# Altium schematic sheet digital_pot.SchDoc
size A4; Engineer: Amir Hossein Jobeiri; Organization: Simaran; SheetNumber: 21; SheetTotal: 24
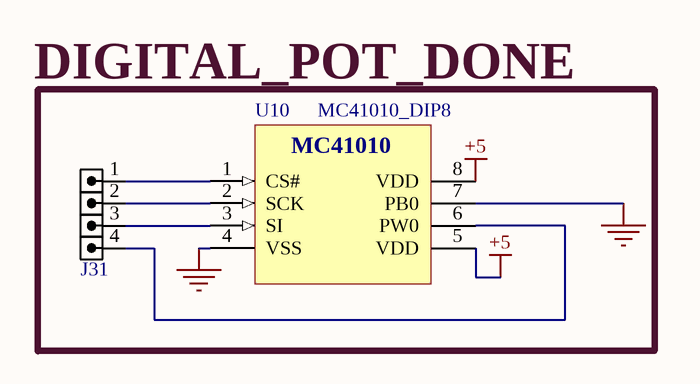
[diagram p0: digital_pot.SchDoc]

## Parts
J31  HDR1X4  [HDR_M_1X4]  (value not drawn)
U10  MC41010_DIP8  [DIP_8]

## Blocks framed on the sheet
DIGITAL_POT_DONE: J31 U10

## Nets
+5: U10.5(VDD) U10.8(VDD)
GND: U10.4(VSS) U10.7(PB0)
NetJ31_1: J31.1 U10.1(CS#)
NetJ31_2: J31.2 U10.2(SCK)
NetJ31_3: J31.3 U10.3(SI)
NetJ31_4: J31.4 U10.6(PW0)

## Notes on the sheet
- (in symbol MCP41010_DIP8) MC41010

## Library data of the parts
J31 = HDR_M_1X4: CONN, HEADER, Male, pitch: 2.54mm, 4POS; VALUE: HDRM4
U10 = MCP41010_DIP8: CREATED BY J / Single/Dual Digital Potentiometer with SPI™ Interface; MANF: MICROCHIP; VALUE: MC41010_DIP8; PARAM: *; PARAM1: *; MANF_P#: *